# Altium schematic sheet Mcu.SchDoc
size A4
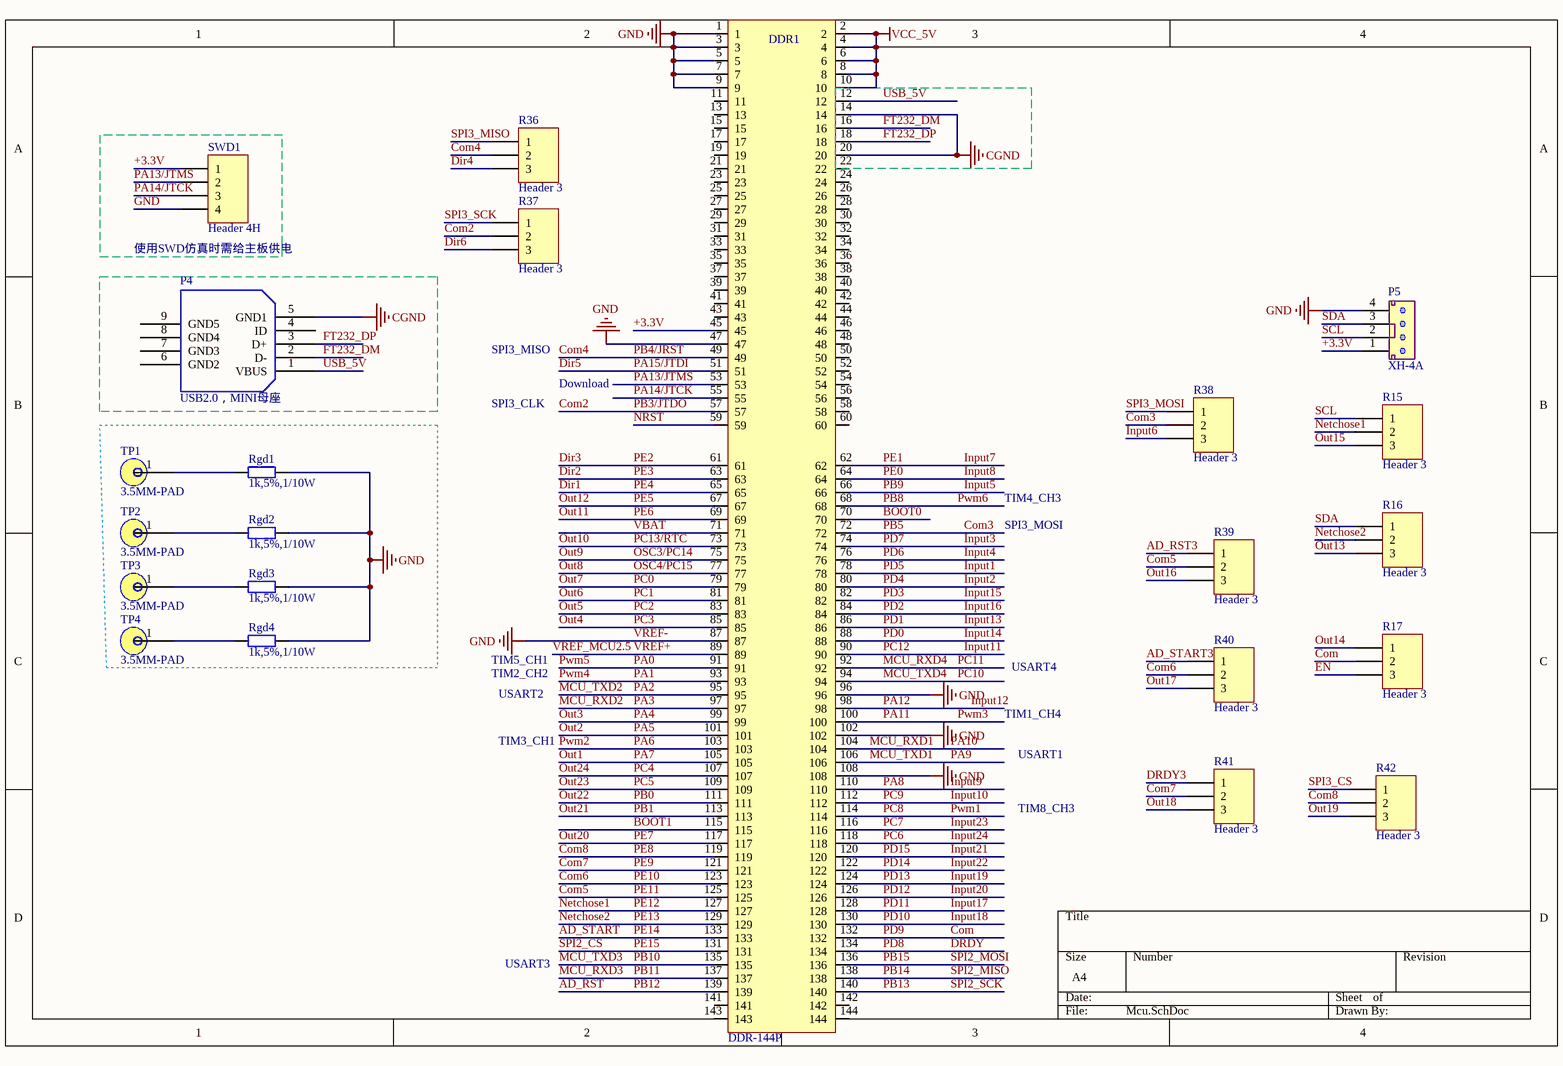
[diagram p0: Mcu.SchDoc]

## Parts
DDR1  DDR-144P  [DDRB-144P-0.8MM]
P4  USB2.0，MINI母座  [USB2.0-MINI]
P5  XH-4A  [CN4-3.5]
R15  Header 3  [3P-0603]
R16  Header 3  [3P-0603]
R17  Header 3  [3P-0603]
R36  Header 3  [3P-0603]
R37  Header 3  [3P-0603]
R38  Header 3  [3P-0603]
R39  Header 3  [3P-0603]
R40  Header 3  [3P-0603]
R41  Header 3  [3P-0603]
R42  Header 3  [3P-0603]
Rgd1  1k,5%,1/10W  [0603R]
Rgd2  1k,5%,1/10W  [0603R]
Rgd3  1k,5%,1/10W  [0603R]
Rgd4  1k,5%,1/10W  [0603R]
SWD1  Header 4H  [SIP4-2.54mm]
TP1  3.5MM-PAD  [PAD3.5mm]
TP2  3.5MM-PAD  [PAD3.5mm]
TP3  3.5MM-PAD  [PAD3.5mm]
TP4  3.5MM-PAD  [PAD3.5mm]

## Blocks framed on the sheet
使用SWD仿真时需给主板供电: SWD1

## Nets
CGND: DDR1.14 DDR1.20 P4.5(GND1)
GND: DDR1.1 DDR1.3 DDR1.5 DDR1.7 DDR1.9 DDR1.47 DDR1.87 DDR1.96 DDR1.102 DDR1.108 P5.4 Rgd1.2 Rgd2.2 Rgd3.2 Rgd4.2 SWD1.4  [also labelled VREF-]
VCC_5V: DDR1.2 DDR1.4 DDR1.6 DDR1.8 DDR1.10
+3.3V: DDR1.45 P5.1 SWD1.1
AD_RST: DDR1.139  [also labelled PB12]
AD_RST3: R39.1
AD_START: DDR1.133  [also labelled PE14]
AD_START3: R40.1
BOOT0: DDR1.70
BOOT1: DDR1.115
Com: DDR1.132 R17.2  [also labelled PD9]
Com2: DDR1.57 R37.2  [also labelled PB3/JTDO]
Com3: DDR1.72 R38.2  [also labelled PB5]
Com4: DDR1.49 R36.2  [also labelled PB4/JRST]
Com5: DDR1.125 R39.2  [also labelled PE11]
Com6: DDR1.123 R40.2  [also labelled PE10]
Com7: DDR1.121 R41.2  [also labelled PE9]
Com8: DDR1.119 R42.2  [also labelled PE8]
Dir1: DDR1.65  [also labelled PE4]
Dir2: DDR1.63  [also labelled PE3]
Dir3: DDR1.61  [also labelled PE2]
Dir4: R36.3
Dir5: DDR1.51  [also labelled PA15/JTDI]
Dir6: R37.3
DRDY: DDR1.134  [also labelled PD8]
DRDY3: R41.1
~{EN}: R17.3
FT232_DM: DDR1.16 P4.2(D-)
FT232_DP: DDR1.18 P4.3(D+)
Input1: DDR1.78  [also labelled PD5]
Input2: DDR1.80  [also labelled PD4]
Input3: DDR1.74  [also labelled PD7]
Input4: DDR1.76  [also labelled PD6]
Input5: DDR1.66  [also labelled PB9]
Input6: R38.3
Input7: DDR1.62  [also labelled PE1]
Input8: DDR1.64  [also labelled PE0]
Input9: DDR1.110  [also labelled PA8]
Input10: DDR1.112  [also labelled PC9]
Input11: DDR1.90  [also labelled PC12]
Input12: DDR1.98  [also labelled PA12]
Input13: DDR1.86  [also labelled PD1]
Input14: DDR1.88  [also labelled PD0]
Input15: DDR1.82  [also labelled PD3]
Input16: DDR1.84  [also labelled PD2]
Input17: DDR1.128  [also labelled PD11]
Input18: DDR1.130  [also labelled PD10]
Input19: DDR1.124  [also labelled PD13]
Input20: DDR1.126  [also labelled PD12]
Input21: DDR1.120  [also labelled PD15]
Input22: DDR1.122  [also labelled PD14]
Input23: DDR1.116  [also labelled PC7]
Input24: DDR1.118  [also labelled PC6]
MCU_RXD1: DDR1.104  [also labelled PA10]
MCU_RXD2: DDR1.97  [also labelled PA3]
MCU_RXD3: DDR1.137  [also labelled PB11]
MCU_RXD4: DDR1.92  [also labelled PC11]
MCU_TXD1: DDR1.106  [also labelled PA9]
MCU_TXD2: DDR1.95  [also labelled PA2]
MCU_TXD3: DDR1.135  [also labelled PB10]
MCU_TXD4: DDR1.94  [also labelled PC10]
Netchose1: DDR1.127 R15.2  [also labelled PE12]
Netchose2: DDR1.129 R16.2  [also labelled PE13]
NRST: DDR1.59
OSC3/PC14: DDR1.75  [also labelled Out9]
OSC4/PC15: DDR1.77  [also labelled Out8]
Out1: DDR1.105  [also labelled PA7]
Out2: DDR1.101  [also labelled PA5]
Out3: DDR1.99  [also labelled PA4]
Out4: DDR1.85  [also labelled PC3]
Out5: DDR1.83  [also labelled PC2]
Out6: DDR1.81  [also labelled PC1]
Out7: DDR1.79  [also labelled PC0]
Out10: DDR1.73  [also labelled PC13/RTC]
Out11: DDR1.69  [also labelled PE6]
Out12: DDR1.67  [also labelled PE5]
Out13: R16.3
Out14: R17.1
Out15: R15.3
Out16: R39.3
Out17: R40.3
Out18: R41.3
Out19: R42.3
Out20: DDR1.117  [also labelled PE7]
Out21: DDR1.113  [also labelled PB1]
Out22: DDR1.111  [also labelled PB0]
Out23: DDR1.109  [also labelled PC5]
Out24: DDR1.107  [also labelled PC4]
PA0: DDR1.91  [also labelled Pwm5]
PA1: DDR1.93  [also labelled Pwm4]
PA6: DDR1.103  [also labelled Pwm2]
PA11: DDR1.100  [also labelled Pwm3]
PA13/JTMS: DDR1.53 SWD1.2
PA14/JTCK: DDR1.55 SWD1.3
PB8: DDR1.68  [also labelled Pwm6]
PB13: DDR1.140  [also labelled SPI2_SCK]
PB14: DDR1.138  [also labelled SPI2_MISO]
PB15: DDR1.136  [also labelled SPI2_MOSI]
PC8: DDR1.114  [also labelled Pwm1]
PE15: DDR1.131  [also labelled SPI2_CS]
SCL: P5.2 R15.1
SDA: P5.3 R16.1
SPI3_CS: R42.1
SPI3_MISO: R36.1
SPI3_MOSI: R38.1
SPI3_SCK: R37.1
USB_5V: DDR1.12 P4.1(VBUS)
VBAT: DDR1.71
VREF+: DDR1.89  [also labelled VREF_MCU2.5]
NetRgd1_1: Rgd1.1 TP1.1
NetRgd2_1: Rgd2.1 TP2.1
NetRgd3_1: Rgd3.1 TP3.1
NetRgd4_1: Rgd4.1 TP4.1

Not connected (* = marked no-connect by the designer): DDR1 11 13 15 17 19 21 22 23 24 25 26 27 28 29 30 31 32 33 34 35 36 37 38 39 40 41 42 43 44 46 48 50 52 54 56 58 60 141 142 143 144; P4 4(ID) 6(GND2) 7(GND3) 8(GND4) 9(GND5)

## Notes on the sheet
- SPI3_MISO
- Download
- SPI3_CLK
- TIM4_CH3
- SPI3_MOSI
- TIM5_CH1
- USART4
- TIM2_CH2
- USART2
- TIM1_CH4
- TIM3_CH1
- USART1
- TIM8_CH3
- USART3

## Library data of the parts
P4 = USB2.0-MINI: USB插座,MINI型母座,USB2.0; 料号: 10705-00008-00; 品名: 数据接口连接器
P5 = CON4
R15-R17 R36-R42 = Header 3: Header, 3-Pin; LatestRevisionDate: 17-Jul-2002; LatestRevisionNote: Re-released for DXP Platform.; Publisher: Altium Limited
Rgd1-Rgd4 = R1K-0603: Metal Film Resistance,金属膜电阻,1K,1%,1/10W,0603; 料号: 11011K0001-000
SWD1 = Header 4H: Header, 4-Pin, Right Angle; LatestRevisionDate: 17-Jul-2002; LatestRevisionNote: Re-released for DXP Platform.; Publisher: Altium Limited